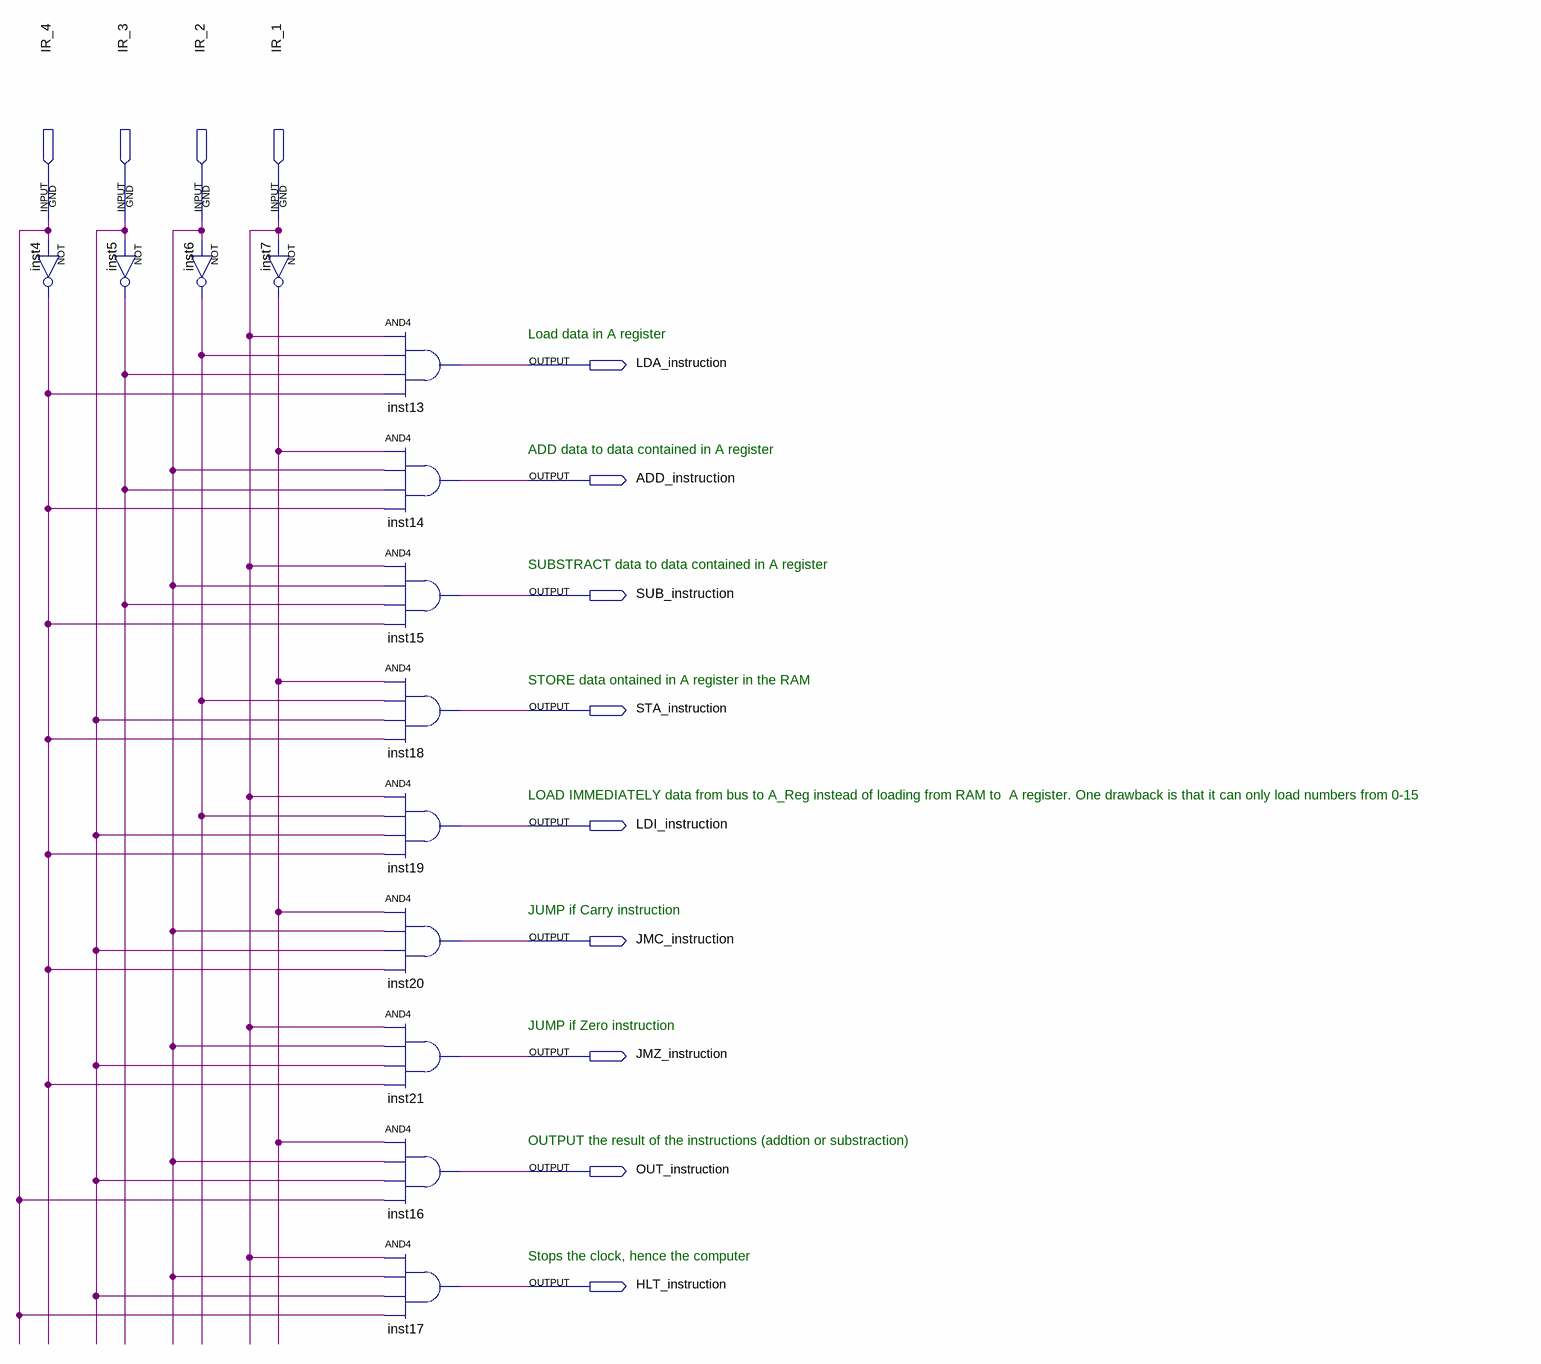
[diagram p0: schematic sheet]
// Quartus schematic Op_Code.bdf as structural Verilog: 13 symbols, 13 pins
module Op_Code (
  input  IR_4,
  input  IR_3,
  input  IR_2,
  input  IR_1,
  output LDA_instruction,
  output ADD_instruction,
  output SUB_instruction,
  output STA_instruction,
  output LDI_instruction,
  output JMC_instruction,
  output JMZ_instruction,
  output OUT_instruction,
  output HLT_instruction
);

  wire inst4_out, inst5_out, inst6_out, inst7_out;

  not inst4 (inst4_out, IR_4);
  not inst5 (inst5_out, IR_3);
  not inst6 (inst6_out, IR_2);
  not inst7 (inst7_out, IR_1);
  and inst13 (LDA_instruction, IR_1, inst6_out, inst5_out, inst4_out);
  and inst14 (ADD_instruction, inst7_out, IR_2, inst5_out, inst4_out);
  and inst15 (SUB_instruction, IR_1, IR_2, inst5_out, inst4_out);
  and inst18 (STA_instruction, inst7_out, inst6_out, IR_3, inst4_out);
  and inst19 (LDI_instruction, IR_1, inst6_out, IR_3, inst4_out);
  and inst20 (JMC_instruction, inst7_out, IR_2, IR_3, inst4_out);
  and inst21 (JMZ_instruction, IR_1, IR_2, IR_3, inst4_out);
  and inst16 (OUT_instruction, inst7_out, IR_2, IR_3, IR_4);
  and inst17 (HLT_instruction, IR_1, IR_2, IR_3, IR_4);

  // Notes on the sheet:
  //   Load data in A register
  //   ADD data to data contained in A register
  //   SUBSTRACT data to data contained in A register
  //   STORE data ontained in A register in the RAM
  //   LOAD IMMEDIATELY data from bus to A_Reg instead of loading from RAM to  A register. One drawback is that it can only load numbers from 0-15
  //   JUMP if Carry instruction
  //   JUMP if Zero instruction
  //   OUTPUT the result of the instructions (addtion or substraction)
  //   Stops the clock, hence the computer
endmodule
